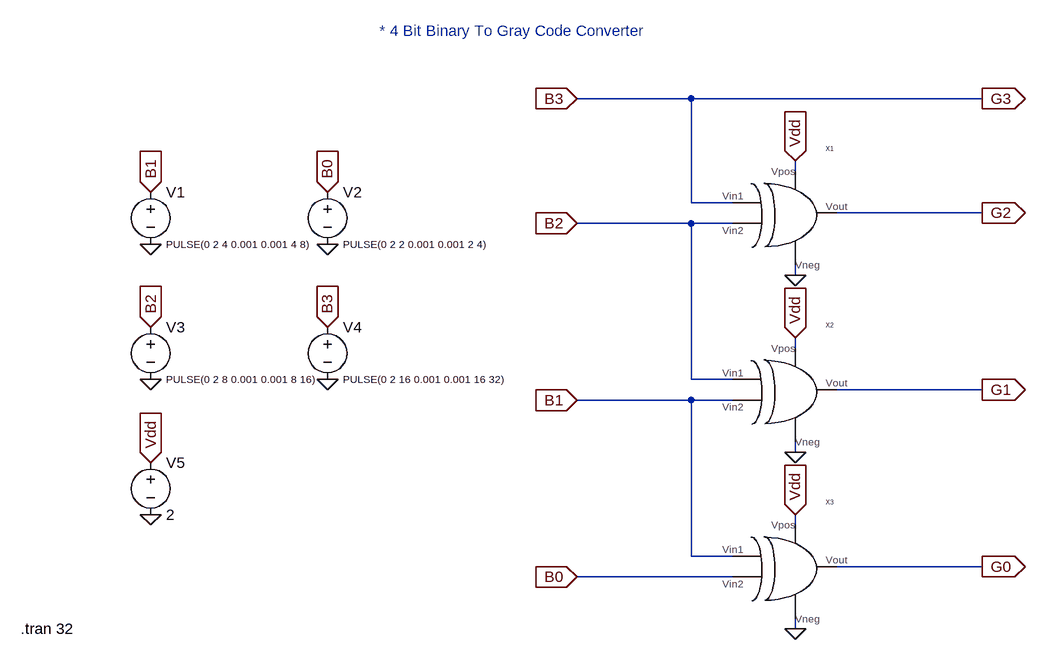
[diagram p0: schematic 4bit Binary to Gray code.asc]
4bit Binary to Gray code.asc, the LTspice schematic file:
Version 4
SHEET 1 880 1012
WIRE 128 176 -48 176
WIRE 576 176 128 176
WIRE 288 288 288 272
WIRE 128 336 128 176
WIRE 192 336 128 336
WIRE 576 352 352 352
WIRE 128 368 -48 368
WIRE 192 368 128 368
WIRE 288 448 288 432
WIRE 288 560 288 544
WIRE 128 608 128 368
WIRE 192 608 128 608
WIRE 576 624 352 624
WIRE 128 640 -48 640
WIRE 192 640 128 640
WIRE 288 720 288 704
WIRE 288 832 288 816
WIRE 128 880 128 640
WIRE 192 880 128 880
WIRE 576 896 352 896
WIRE 192 912 -48 912
WIRE 288 992 288 976
FLAG -704 736 Vdd
IOPIN -704 736 In
FLAG 288 816 Vdd
IOPIN 288 816 In
FLAG 288 544 Vdd
IOPIN 288 544 In
FLAG 288 272 Vdd
IOPIN 288 272 In
FLAG -432 320 B0
IOPIN -432 320 In
FLAG -48 912 B0
IOPIN -48 912 In
FLAG -704 320 B1
IOPIN -704 320 In
FLAG -48 640 B1
IOPIN -48 640 In
FLAG -704 528 B2
IOPIN -704 528 In
FLAG -48 368 B2
IOPIN -48 368 In
FLAG 288 448 0
FLAG 288 720 0
FLAG 288 992 0
FLAG -704 816 0
FLAG -432 608 0
FLAG -704 608 0
FLAG -704 400 0
FLAG -432 400 0
FLAG 576 176 G3
IOPIN 576 176 Out
FLAG 576 352 G2
IOPIN 576 352 Out
FLAG 576 624 G1
IOPIN 576 624 Out
FLAG 576 896 G0
IOPIN 576 896 Out
FLAG -432 528 B3
IOPIN -432 528 In
FLAG -48 176 B3
IOPIN -48 176 In
SYMBOL xor 336 336 R0
SYMATTR InstName X1
SYMBOL xor 336 608 R0
SYMATTR InstName X2
SYMBOL xor 336 880 R0
SYMATTR InstName X3
SYMBOL voltage -704 304 R0
WINDOW 3 24 96 Left 1
WINDOW 123 0 0 Left 0
WINDOW 39 0 0 Left 0
SYMATTR Value PULSE(0 2 4 0.001 0.001 4 8)
SYMATTR InstName V1
SYMBOL voltage -432 304 R0
WINDOW 3 24 96 Left 1
WINDOW 123 0 0 Left 0
WINDOW 39 0 0 Left 0
SYMATTR Value PULSE(0 2 2 0.001 0.001 2 4)
SYMATTR InstName V2
SYMBOL voltage -704 512 R0
WINDOW 3 24 96 Left 1
WINDOW 123 0 0 Left 0
WINDOW 39 0 0 Left 0
SYMATTR Value PULSE(0 2 8 0.001 0.001 8 16)
SYMATTR InstName V3
SYMBOL voltage -432 512 R0
WINDOW 3 24 96 Left 1
WINDOW 123 0 0 Left 0
WINDOW 39 0 0 Left 0
SYMATTR Value PULSE(0 2 16 0.001 0.001 16 32)
SYMATTR InstName V4
SYMBOL voltage -704 720 R0
WINDOW 123 0 0 Left 0
WINDOW 39 0 0 Left 0
SYMATTR InstName V5
SYMATTR Value 2
TEXT -904 992 Left 2 !.tran 32
TEXT -352 72 Left 2 ;* 4 Bit Binary To Gray Code Converter

The netlist it stands for:
* 4bit Binary to Gray code.asc
XX1 B3 B2 Vdd 0 G2 xor  ; pins A B vdd gnd Y
XX2 B2 B1 Vdd 0 G1 xor  ; pins A B vdd gnd Y
XX3 B1 B0 Vdd 0 G0 xor  ; pins A B vdd gnd Y
V1 B1 0 PULSE(0 2 4 0.001 0.001 4 8)
V2 B0 0 PULSE(0 2 2 0.001 0.001 2 4)
V3 B2 0 PULSE(0 2 8 0.001 0.001 8 16)
V4 B3 0 PULSE(0 2 16 0.001 0.001 16 32)
V5 Vdd 0 2
.tran 32
* * 4 Bit Binary To Gray Code Converter
.backanno
.end